# EAGLE schematic mc-v1-sch (EAGLE 9.2.2)
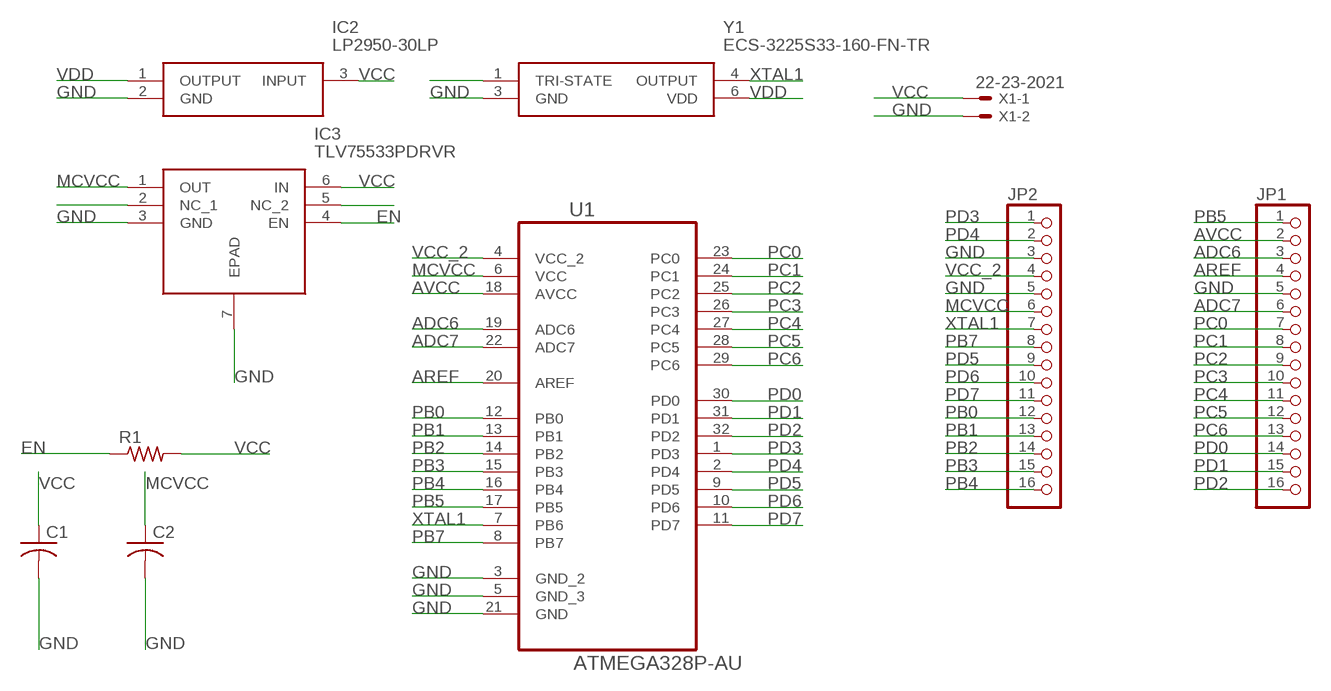
[diagram p0: schematic, sheet 1]

## Parts
C1  C-USC1206  [C1206]
C2  C-USC1206  [C1206]
IC2  LP2950-30LP  [LP0003A]
IC3  TLV75533PDRVR  [SON65P200X200X80-7N]
JP1  PINHD-1X16  [1X16]
JP2  PINHD-1X16  [1X16]
R1  R-US_R0603  [R0603]
U1  ATMEGA328P-AU  [QFP80P900X900X120-32N]
X1  22-23-2021  [22-23-2021]
Y1  ECS-3225S33-160-FN-TR  [ECS3225S33200FNTR]

## Nets
ADC6: JP1.3 U1.19(ADC6)
ADC7: JP1.6 U1.22(ADC7)
AREF: JP1.4 U1.20(AREF)
AVCC: JP1.2 U1.18(AVCC)
EN: IC3.4(EN) R1.1
GND: C1.2 C2.2 IC2.2(GND) IC3.3(GND) IC3.7(EPAD) JP1.5 JP2.3 JP2.5 U1.3(GND_2) U1.5(GND_3) U1.21(GND) X1.2 Y1.3(GND)
MCVCC: C2.1 IC3.1(OUT) JP2.6 U1.6(VCC)
N$1: Y1.1(TRI-STATE)
N$5: IC3.2(NC_1)
N$8: IC3.5(NC_2)
PB0: JP2.12 U1.12(PB0)
PB1: JP2.13 U1.13(PB1)
PB2: JP2.14 U1.14(PB2)
PB3: JP2.15 U1.15(PB3)
PB4: JP2.16 U1.16(PB4)
PB5: JP1.1 U1.17(PB5)
PB7: JP2.8 U1.8(PB7)
PC0: JP1.7 U1.23(PC0)
PC1: JP1.8 U1.24(PC1)
PC2: JP1.9 U1.25(PC2)
PC3: JP1.10 U1.26(PC3)
PC4: JP1.11 U1.27(PC4)
PC5: JP1.12 U1.28(PC5)
PC6: JP1.13 U1.29(PC6)
PD0: JP1.14 U1.30(PD0)
PD1: JP1.15 U1.31(PD1)
PD2: JP1.16 U1.32(PD2)
PD3: JP2.1 U1.1(PD3)
PD4: JP2.2 U1.2(PD4)
PD5: JP2.9 U1.9(PD5)
PD6: JP2.10 U1.10(PD6)
PD7: JP2.11 U1.11(PD7)
VCC: C1.1 IC2.3(INPUT) IC3.6(IN) R1.2 X1.1
VCC_2: JP2.4 U1.4(VCC_2)
VDD: IC2.1(OUTPUT) Y1.6(VDD)
XTAL1: JP2.7 U1.7(PB6) Y1.4(OUTPUT)

## Library data of the parts
C1 C2 = rcl:C-US: CAPACITOR, American symbol; SPICEPREFIX: C
IC2 = LP2950-30LP:LP2950-30LP: Adjustable Micropower Voltage Regulator With Shutdown Source: Datasheet <http://www.ti.com/lit/gpn/LP2950>; DESCRIPTION: Adjustable Micropower Voltage Regulator With Shutdown; HEIGHT: mm; MANUFACTURER_NAME: Texas Instruments; MANUFACTURER_PART_NUMBER: LP2950-30LP; MOUSER_PART_NUMBER: 595-LP2950-30LP; MOUSER_PRICE-STOCK: https://www.mouser.com/Search/Refine.aspx?Keyword=595-LP2950-30LP; RS_PART_NUMBER: 7620437; RS_PRICE-STOCK: https://uk.rs-online.com/web/p/products/7620437
IC3 = TLV75533PDRVR:TLV75533PDRVR: 500-mA low-IQ small-size low-dropout (LDO) regulator Source: Datasheet <http://www.ti.com/lit/gpn/tlv755p>; DESCRIPTION: 500-mA low-IQ small-size low-dropout (LDO) regulator; HEIGHT: 0.8mm; MANUFACTURER_NAME: Texas Instruments; MANUFACTURER_PART_NUMBER: TLV75533PDRVR; MOUSER_PART_NUMBER: 595-TLV75533PDRVR; MOUSER_PRICE-STOCK: https://www.mouser.com/Search/Refine.aspx?Keyword=595-TLV75533PDRVR
JP1 JP2 = pinhead:PINHD-1X16: PIN HEADER
R1 = rcl:R-US_: RESISTOR, American symbol; SPICEPREFIX: R
U1 = Atmel_By_element14_Batch_1-00:ATMEGA328P-AU: 8-bit Microcontroller with In-System Programmable Flash; MPN: ATMEGA328P-AU; OC_FARNELL: 1715486; OC_NEWARK: 14R4631; PACKAGE: TQFP-32; SUPPLIER: Atmel
X1 = con-molex:22-23-2021: .100" (2.54mm) Center Header - 2 Pin; MF: MOLEX; MPN: 22-23-2021; OC_FARNELL: 1462926; OC_NEWARK: 25C3832
Y1 = ECS-3225S33-160-FN-TR:ECS-3225S33-160-FN-TR: Standard Clock Oscillators 16MHz 3.3V 10ppm -40C +85C Source: Datasheet <https://ecsxtal.com/store/pdf/ECS-3225S.pdf>; DESCRIPTION: Standard Clock Oscillators 16MHz 3.3V 10ppm -40C +85C; HEIGHT: 1mm; MANUFACTURER_NAME: ECS; MANUFACTURER_PART_NUMBER: ECS-3225S33-160-FN-TR; MOUSER_PART_NUMBER: 520-3225S33-160-FNT; MOUSER_PRICE-STOCK: https://www.mouser.com/Search/Refine.aspx?Keyword=520-3225S33-160-FNT